# Altium schematic sheet cover.SchDoc: Cover
size A4; Organization: GPA Robotics
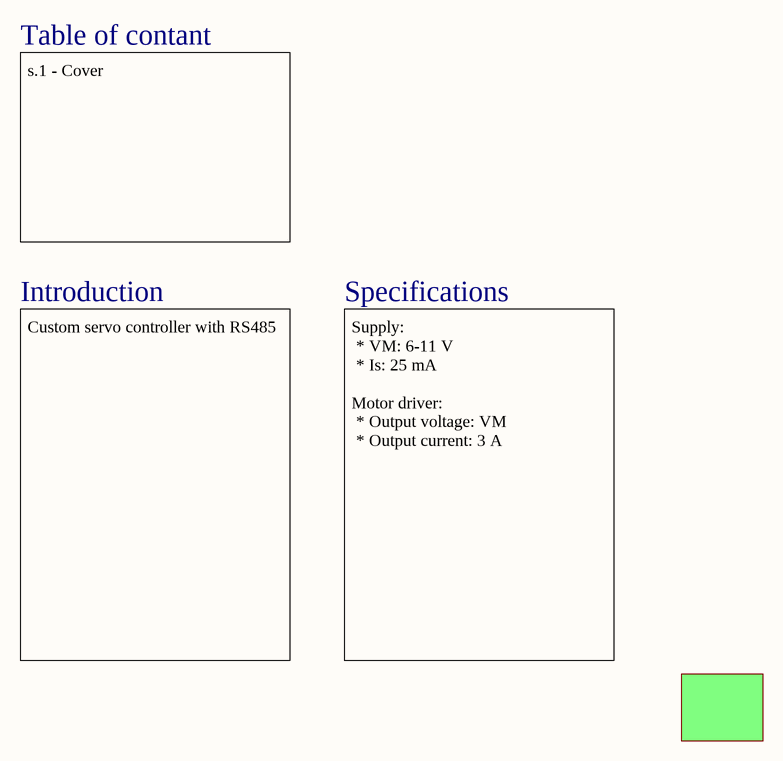
[diagram p0: cover.SchDoc]

## Sub-sheets
CTL = control.SchDoc: no entries

## Notes on the sheet
- Table of contant
- s.1 - Cover
- Introduction
- Specifications
- Custom servo controller with RS485
- Supply:
  * VM: 6-11 V
  * Is: 25 mA
  Motor driver:
  * Output voltage: VM
  * Output current: 3 A
- Variant:
- Title
- Size:
- Date:
- A4
- Number:
- Time:
- Revision:
- Sheet
- of
- Repo: